# EasyEDA Pro project Tasmota_ESP32C6-RTC_Triac.eprj

# Schematic SSR_4A_5V
Board Name: SSR_4A_5V; Create Date: 2026-10-08; Page Name: P1; Project Name: Tasmota_ESP32C6-6c; Schematic Name: SSR_4A_5V; Update Date: 2026-10-08; Company: EasyEDA.com; Page Size: A4; Version: V1.0
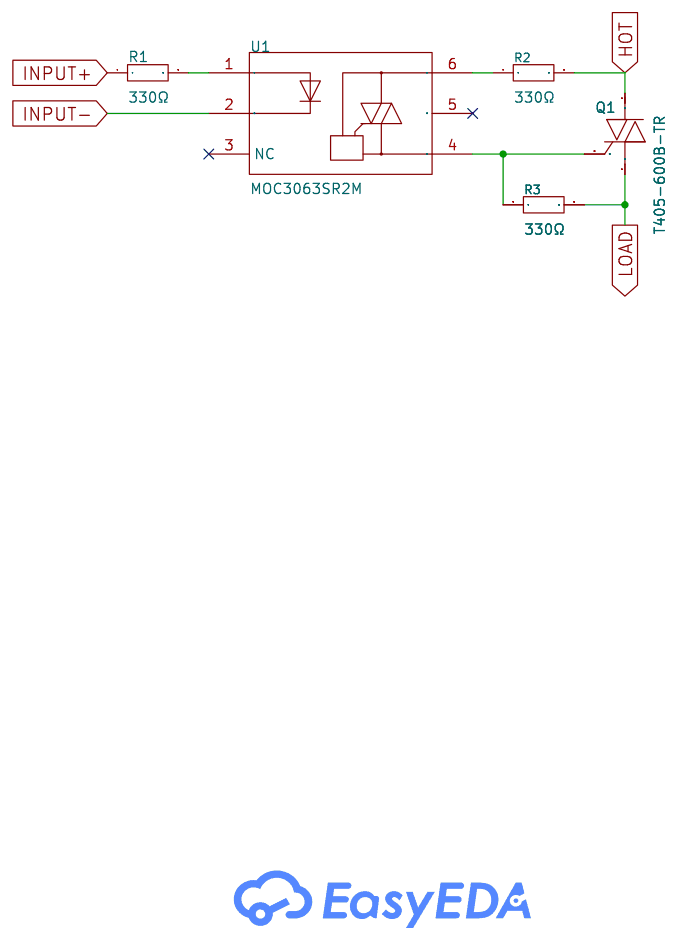
[diagram p0: schematic sheet]

## Parts
Q1  T405-600B-TR  [DPAK_L6.5-W6.0-P2.29-LS9.9-TL]
R1  330Ω  [R0805]
R2  330Ω  [R0805]
R3  330Ω  [R0805]
U1  MOC3063SR2M  [SOP-6_L8.5-W6.4-P2.54-LS9.2-BL]

## Library data of the parts
Q1 = T405-600B-TR: SCR Type:- Peak off - state voltage(Vdrm):600V Current - On State(It(RMS)):4A Current - Surge(Itsm@f):30A Average Gate Power Dissipation (PG(AV)):1W Voltage - On State(Vtm):1.56V Current - Gate Trigger(Igt):5mA Gate Trigger   Voltage (Vgt):1.3V Holding Cu; LCSC Part Name: 600V 10mA; Supplier Part: C283473; Manufacturer: ST(意法半导体); Supplier Footprint: DPAK; JLCPCB Part Class: Extended Part; Datasheet: https://item.szlcsc.com/datasheet/T405-600B-TR/269286.html; Supplier: LCSC; Peak off - state voltage(Vdrm): 600V; Current - On State(It(RMS)): 4A; Current - Surge(Itsm@f): 30A; Average Gate Power Dissipation (PG(AV)): 1W; Voltage - On State(Vtm): 1.56V; Current - Gate Trigger(Igt): 5mA; Gate Trigger   Voltage (Vgt): 1.3V; Holding Current (Ih): 10mA; Operating Temperature: -40℃~+125℃
R1-R3 = 0805W8F3300T5E: Type:Thick Film Resistor Resistance:330Ω Tolerance:±1% Tolerance:±1% Power(Watts):125mW Voltage-Supply(Max):150V Temperature Coefficient:±100ppm/℃ Temperature Coefficient:±100ppm/℃ Operating Temperature:-55℃~+155℃ Operating Temperature:-55℃~+155℃; LCSC Part Name: 厚膜电阻 330Ω ±1%; Supplier Part: C17630; Manufacturer: UNI-ROYAL(厚声); Supplier Footprint: 0805; JLCPCB Part Class: Basic Part; Datasheet: https://item.szlcsc.com/datasheet/0805W8F3300T5E/18318.html; Supplier: LCSC; Type: Thick Film Resistor; Tolerance: ±1%; Power(Watts): 125mW; Voltage-Supply(Max): 150V; Temperature Coefficient: ±100ppm/℃; Operating Temperature: -55℃~+155℃
U1 = MOC3063SR2M: Number of Channels:1 Zero Crossing Circuit:Yes Input Type:DC Output Type:TRIAC Load Voltage:600V Output Current(It(rms)):- Voltage - Forward(Vf):1.3V Forward Current:60mA Static dv/dt:600V/us Isolation Voltage(Vrms):7.5kV Power Dissipation:250mW Operating; LCSC Part Name: 双向可控硅 有过零电路 1通道; Supplier Part: C13411; Manufacturer: onsemi(安森美); Supplier Footprint: SOP-6-2.54mm; JLCPCB Part Class: Extended Part; Datasheet: https://item.szlcsc.com/datasheet/MOC3063SR2M/14060.html; Supplier: LCSC; Number of Channels: 1; Zero Crossing Circuit: Yes; Input Type: DC; Output Type: TRIAC; Load Voltage: 600V; Voltage - Forward(Vf): 1.3V; Forward Current: 60mA; Static dv/dt: 600V/us; Isolation Voltage(Vrms): 7.5kV; Power Dissipation: 250mW; Operating Temperature: -40℃~+85℃; Number of terminals: 6; Holding Current (Ih): 500uA; Current - Surge(Itsm): 1A; Features: Zero-crossing trigger

## Nets
HOT: Q1.4(A2) R2.2
INPUT+: R1.1
INPUT-: U1.2(CAT)
LOAD: Q1.1(A1) R3.2
$1N339: R1.2 U1.1(AN)
$1N2139: Q1.3(G) R3.1 U1.4(MT)
$1N2143: R2.1 U1.6(MT)

Not connected (* = marked no-connect by the designer): U1 3(NC)* 5(NC)*

# Schematic Tasmota_ESP32C6-5c_NoSSR

## Sheets
1 Tasmota_ESP32C6-5c_1: Board Name: Tasmota_ESP32C6-5c_NoSSR RTC; Create Date: 2026-10-08; Page Name: Tasmota_ESP32C6-5c_1; Project Name: Tasmota_ESP32C6-6c; Schematic Name: Tasmota_ESP32C6-5c_NoSSR; Update Date: 2026-10-09; Company: EasyEDA.com; Page Size: A5; Version: V1.0
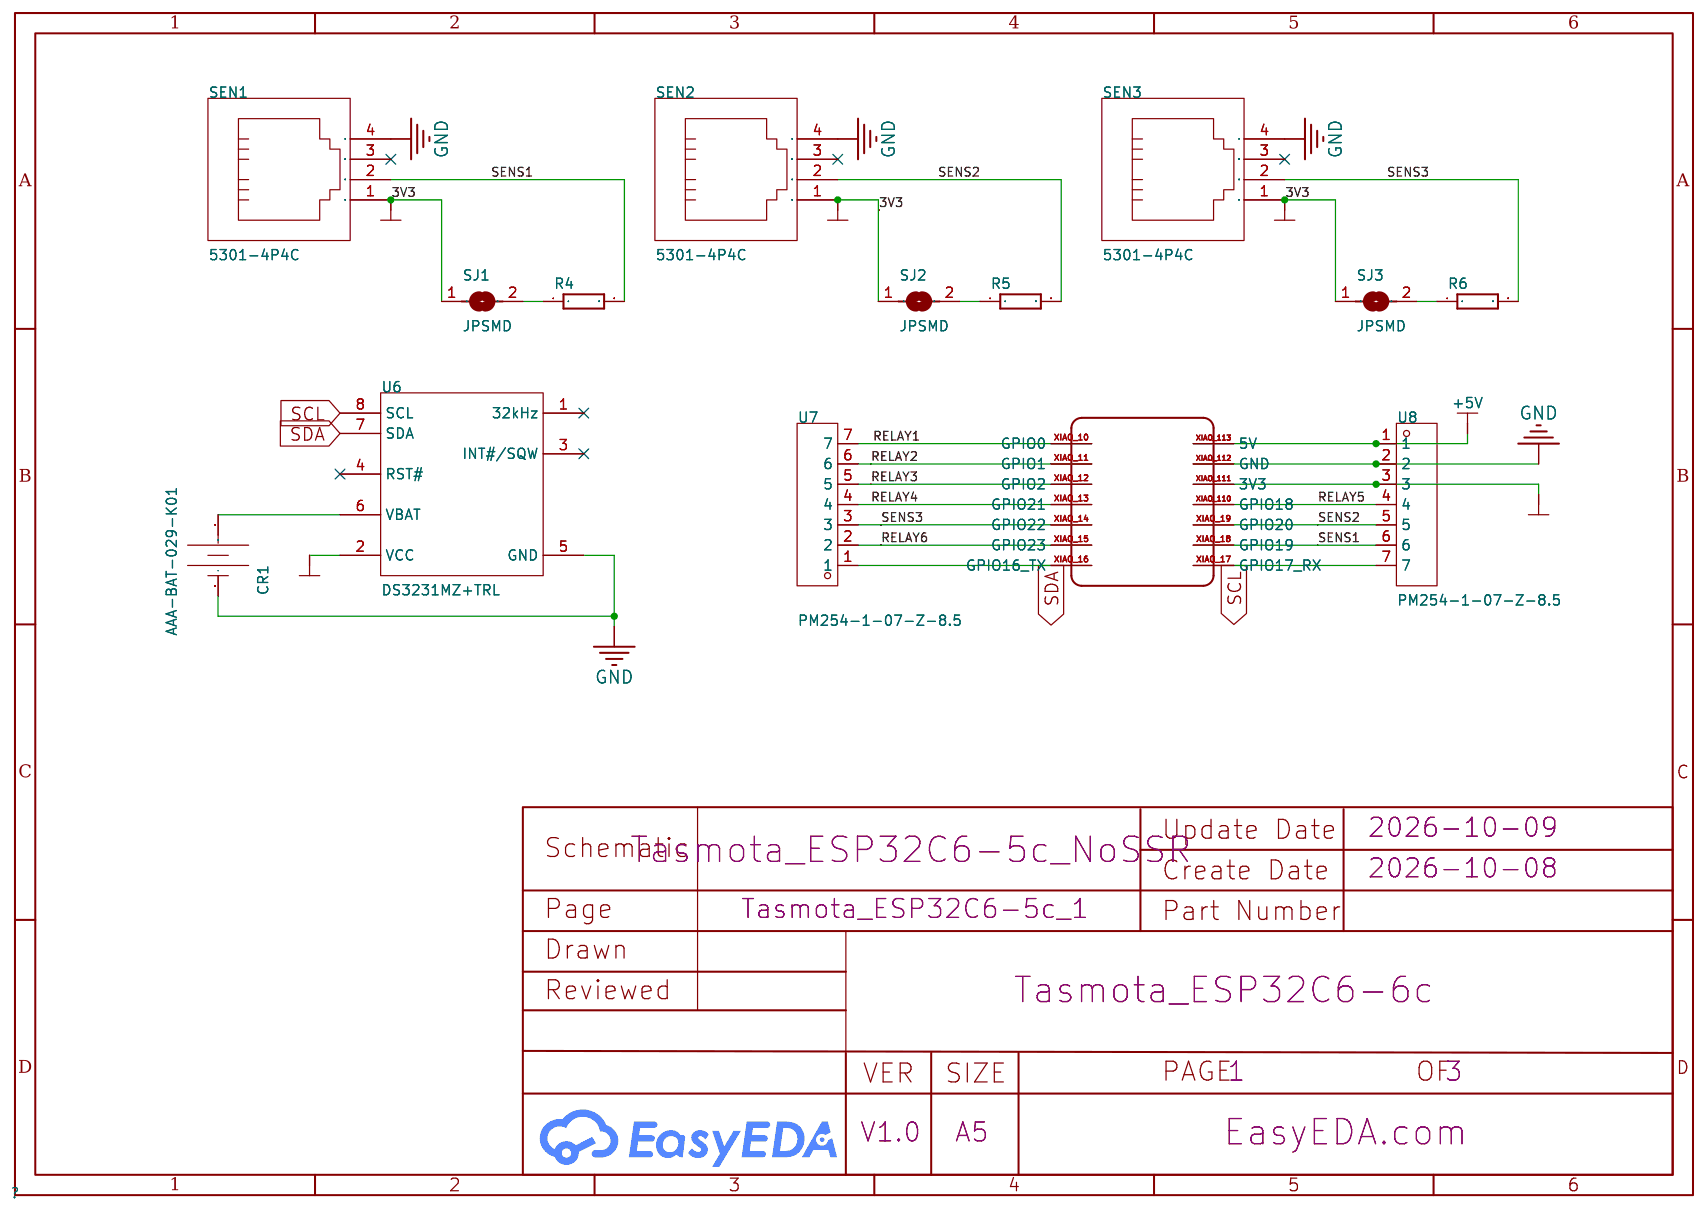
[diagram p1: Tasmota_ESP32C6-5c_1]
2 Tasmota_ESP32C6-5c_2: Page Name: Tasmota_ESP32C6-5c_2
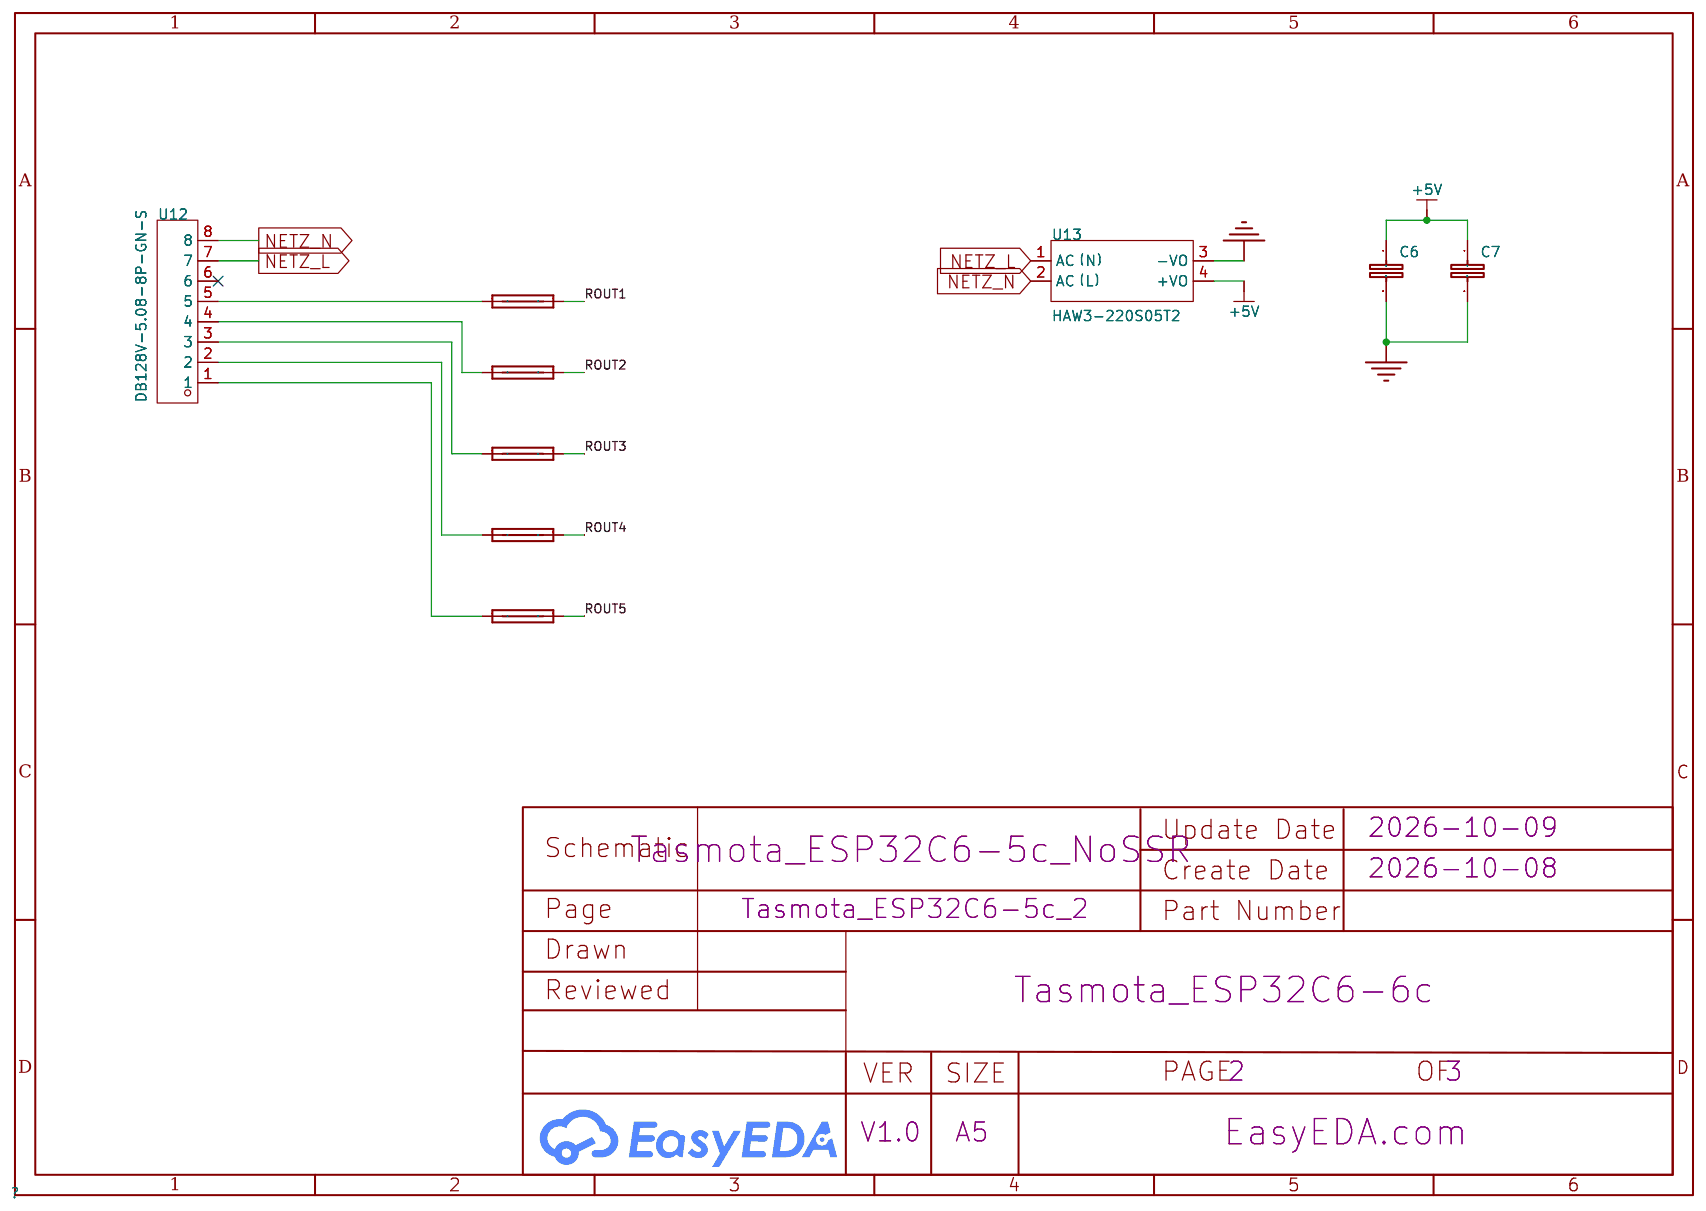
[diagram p2: Tasmota_ESP32C6-5c_2]
3 Tasmota_ESP32C6-5c_3: Page Name: Tasmota_ESP32C6-5c_3; Page Size: A4
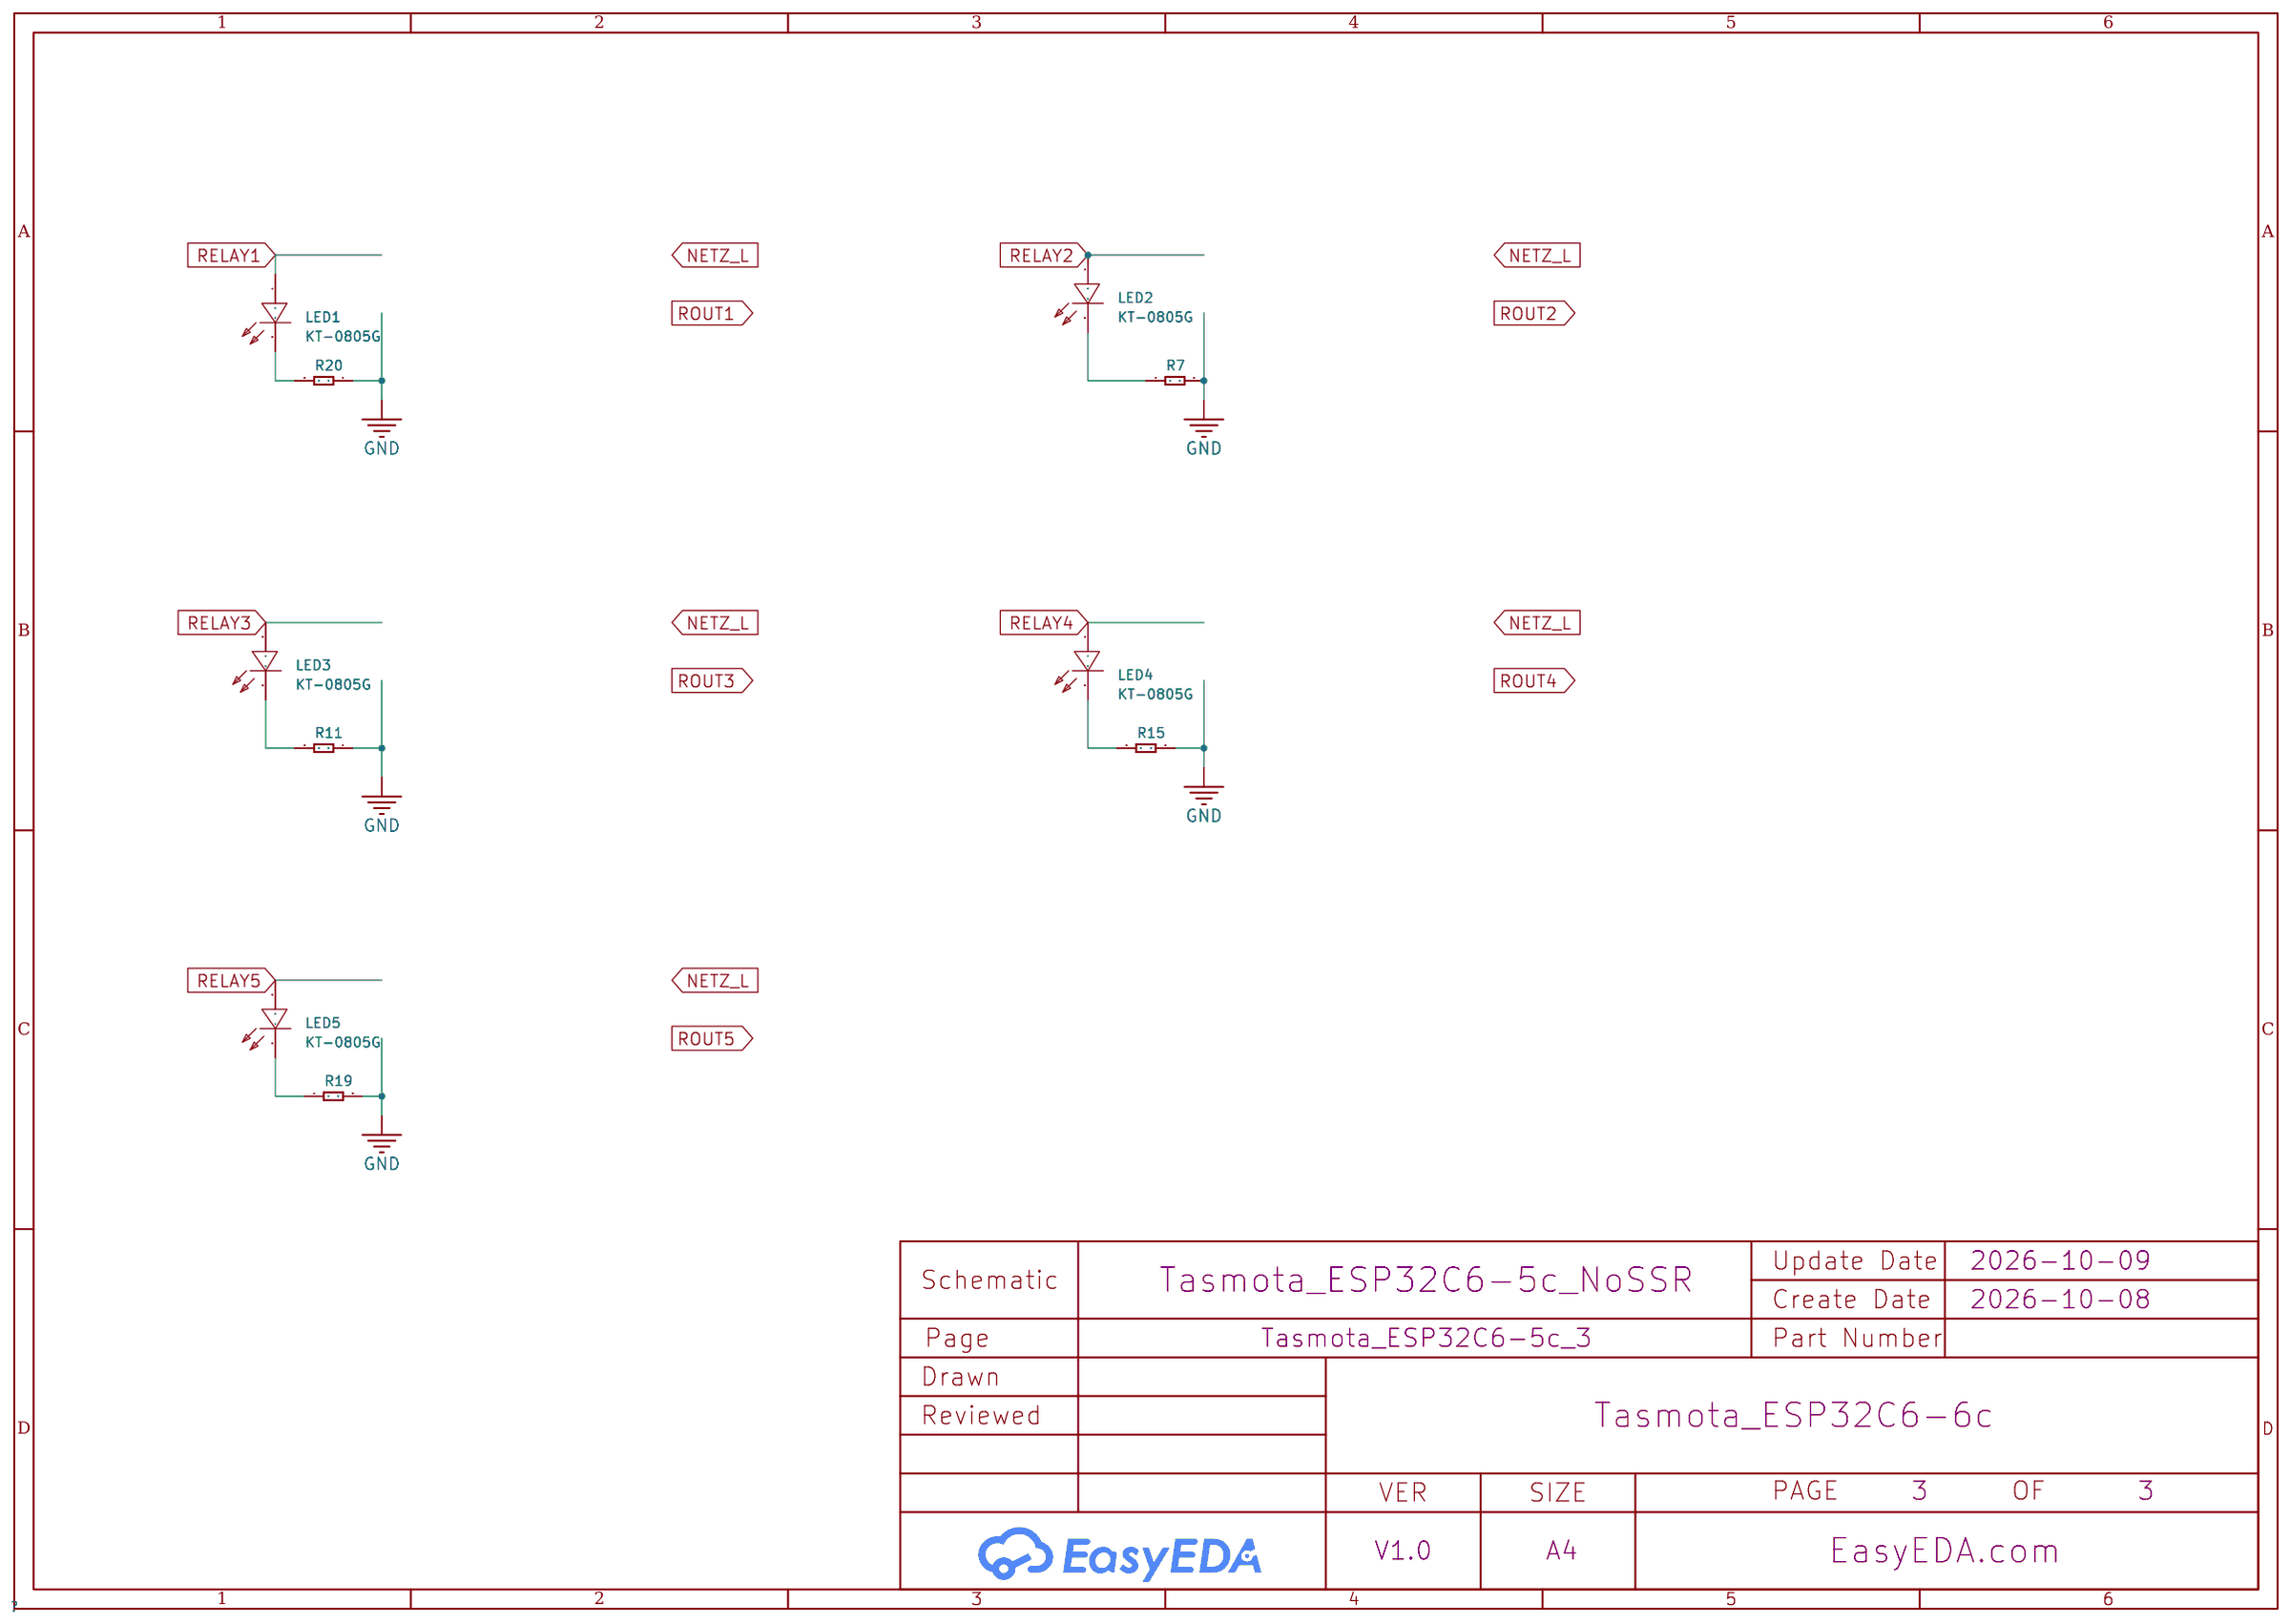
[diagram p3: Tasmota_ESP32C6-5c_3]

## Parts
sheet Tasmota_ESP32C6-5c_1
CR1  AAA-BAT-029-K01  [BAT-TH_AAA-BAT-029-K01]
R4  4.7kΩ  [R0805]
R5  4.7kΩ  [R0805]
R6  4.7kΩ  [R0805]
SEN1  5301-4P4C  [RJ11-TH_RJ11-4P4C]
SEN2  5301-4P4C  [RJ11-TH_RJ11-4P4C]
SEN3  5301-4P4C  [RJ11-TH_RJ11-4P4C]
SJ1  JPSMD  [SJ]
SJ2  JPSMD  [SJ]
SJ3  JPSMD  [SJ]
U6  DS3231MZ+TRL  [SOIC-8_L4.9-W3.9-P1.27-LS6.0-BL]
U7  PM254-1-07-Z-8.5  [HDR-TH_7P-P2.54-V-F]
U8  PM254-1-07-Z-8.5  [HDR-TH_7P-P2.54-V-F]
U$1  1x7P  [XIAO_ESP32C6]  (no BOM)
sheet Tasmota_ESP32C6-5c_2
C6  22uF  [C0805]
C7  100nF  [C0805]
F1  56000001009  [FUSE-TH_BD9.5-P5.08-D1.0]
F2  56000001009  [FUSE-TH_BD9.5-P5.08-D1.0]
F3  56000001009  [FUSE-TH_BD9.5-P5.08-D1.0]
F4  56000001009  [FUSE-TH_BD9.5-P5.08-D1.0]
F5  56000001009  [FUSE-TH_BD9.5-P5.08-D1.0]
U12  DB128V-5.08-8P-GN-S  [CONN-TH_8P-P5.08_DB128V-5.08-8P-GN-S]
U13  HAW3-220S05T2  [PWRM-TH_HAW3-220S05T2]
sheet Tasmota_ESP32C6-5c_3
CBB1  -
CBB2  -
CBB3  -
CBB4  -
CBB5  -
LED1  KT-0805G  [LED0805-R-RD]
LED2  KT-0805G  [LED0805-R-RD]
LED3  KT-0805G  [LED0805-R-RD]
LED4  KT-0805G  [LED0805-R-RD]
LED5  KT-0805G  [LED0805-R-RD]
R7  220Ω  [R0805]
R11  220Ω  [R0805]
R15  220Ω  [R0805]
R19  220Ω  [R0805]
R20  220Ω  [R0805]

## Library data of the parts
CR1 = AAA-BAT-029-K01: Connector Type:Battery Holder Battery Type:CR2032 Operating Temperature:- Operating Temperature:-; LCSC Part Name: 电池底座 适用电池:CR2032; Supplier Part: C962133; Manufacturer: LOTES(嘉澤端子); Supplier Footprint: 插件; JLCPCB Part Class: Extended Part; Datasheet: https://item.szlcsc.com/datasheet/AAA-BAT-029-K01/1043085.html; Supplier: LCSC; Connector Type: Battery Holder; Battery Type: CR2032
R4-R6 = 0805W8F4701T5E: Type:Thick Film Resistors Resistance:4.7kΩ Tolerance:±1% Tolerance:±1% Power(Watts): Overload Voltage (Max): Temperature Coefficient:±100ppm/℃ Temperature Coefficient:±100ppm/℃ Operating Temperature Range:-55℃~+155℃ Operating Temperature Range:-55℃~+155℃; LCSC Part Name: 4.7kΩ ±1% 125mW 厚膜电阻; Supplier Part: C17673; Manufacturer: UNI-ROYAL(厚声); Supplier Footprint: 0805; JLCPCB Part Class: Basic Part; Datasheet: https://atta.szlcsc.com/upload/public/pdf/source/20200306/C422600_1E6D84923E4A46A82E41ADD87F860B5C.pdf; Supplier: LCSC; Type: Thick Film Resistors; Tolerance: ±1%; Temperature Coefficient: ±100ppm/℃; Operating Temperature Range: -55℃~+155℃
SEN1-SEN3 = 5301-4P4C: Connector Type:RJ11 Jack Mounting Type:Right Angle Number of Ports:1 LED:Non-LED Shielding:Unshielded PoE:Non-PoE Supplementary Features:Harpoon Contact (Plastic) Contact Material:Phosphor Bronze Contact Plating:Gold Operating Temperature:-40℃~+85℃ Operat; LCSC Part Name: 弯插 不带LED; Supplier Part: C3097715; Manufacturer: EVERCOM(恒连); Supplier Footprint: 弯插; JLCPCB Part Class: Extended Part; Datasheet: https://item.szlcsc.com/datasheet/5301-4P4C/3657110.html; Supplier: LCSC; Connector Type: RJ11 Jack; Mounting Type: Right Angle; Number of Ports: 1; LED: Non-LED; Shielding: Unshielded; PoE: Non-PoE; Supplementary Features: Harpoon Contact (Plastic); Contact Material: Phosphor Bronze; Contact Plating: Gold; Operating Temperature: -40℃~+85℃
SJ1-SJ3 = jumper_SJ_: POPULARITY: 33
U6 = DS3231MZ+TRL: Interface:I2C Voltage - Supply:2.3V~5.5V Voltage - Supply:2.3V~5.5V Operating Temperature:-40℃~+85℃ Operating Temperature:-40℃~+85℃; LCSC Part Name: 高精度RTC集成MEMS谐振器; Supplier Part: C107410; Manufacturer: ADI(亚德诺)/MAXIM(美信); Supplier Footprint: SOIC-8; JLCPCB Part Class: Extended Part; Datasheet: https://item.szlcsc.com/datasheet/DS3231MZ%252BTRL/108629.html; Supplier: LCSC; Interface: I2C; Voltage - Supply: 2.3V~5.5V; Operating Temperature: -40℃~+85℃
U7 U8 = PM254-1-07-Z-8.5: Holes Structure:1x7P Pitch:2.54mm Row Spacing:- Circular Hole / Square Hole:Square Hole Mounting Type:Through Hole Number of Rows:1 Number of Positions:7P Current Rating:3A Voltage Rating (Max):- Holes Direction:Top Insulation Height:8.5mm Contact Materia; LCSC Part Name: 1x7P 间距:2.54mm 直插; Supplier Part: C2897370; Manufacturer: HCTL(华灿天禄); Supplier Footprint: 插件,P=2.54mm; JLCPCB Part Class: Extended Part; Datasheet: https://item.szlcsc.com/datasheet/PM254-1-07-Z-8.5/3142375.html; Supplier: LCSC; Holes Structure: 1x7P; Pitch: 2.54mm; Circular Hole / Square Hole: Square Hole; Mounting Type: Through Hole; Number of Rows: 1; Number of Positions: 7P; Current Rating: 3A; Holes Direction: Top; Insulation Height: 8.5mm; Contact Material: Copper Alloy; Operating Temperature: -40℃~+105℃
U$1 = MK312parts_XIAO_ESP32C6_
C6 = CL21A226MAQNNNE: Capacitance:22uF Tolerance:±20% Tolerance:±20% Voltage Rating:25V Temperature Coefficient:X5R; LCSC Part Name: 22uF ±20% 25V; Supplier Part: C45783; Manufacturer: SAMSUNG(三星); Supplier Footprint: 0805; JLCPCB Part Class: Basic Part; Datasheet: https://item.szlcsc.com/datasheet/CL21A226MAQNNNE/46786.html; Supplier: LCSC; Tolerance: ±20%; Voltage Rating: 25V; Temperature Coefficient: X5R; POPULARITY: 88; SPICEPREFIX: C
C7 = CL21B104KCFNNNE: Capacitance:100nF Tolerance:±10% Tolerance:±10% Voltage Rating:100V Temperature Coefficient:X7R; LCSC Part Name: 100nF ±10% 100V; Supplier Part: C28233; Manufacturer: SAMSUNG(三星); Supplier Footprint: 0805; JLCPCB Part Class: Basic Part; Datasheet: https://item.szlcsc.com/datasheet/CL21B104KCFNNNE/28983.html; Supplier: LCSC; Tolerance: ±10%; Voltage Rating: 100V; Temperature Coefficient: X7R; POPULARITY: 88; SPICEPREFIX: C
F1-F5 = 56000001009: Fuseholder Type:- Voltage Rating:250V Current Rating:6.3A Fuse Type:-; LCSC Part Name: 保险丝座; Supplier Part: C142909; Manufacturer: Littelfuse(美国力特); Supplier Footprint: 插件,P=5.08mm; JLCPCB Part Class: Extended Part; Datasheet: https://item.szlcsc.com/datasheet/56000001009/154240.html; Supplier: LCSC; Voltage Rating: 250V; Current Rating: 6.3A
U12 = DB128V-5.08-8P-GN-S: Number of Positions or Pins:1x8P Pitch:5.08mm Color:Green Mounting Type:Through Hole Number of Pins:8P Number of Rows:1 Number of PINs Per Row:8 Screw Specification:M2.5 Current Rating:16A Voltage Rating (Max):300V Wire Gauge - AWG:12~22 Wire Gauge - mm2:; LCSC Part Name: 1x8P 5.08mm 直插 排数:1 每排P数:8; Supplier Part: C5143711; Manufacturer: DORABO(地博电气); Supplier Footprint: 插件,P=5.08mm; JLCPCB Part Class: Extended Part; Datasheet: https://item.szlcsc.com/datasheet/DB128V-5.08-8P-GN-S/5763845.html; Supplier: LCSC; Number of Positions or Pins: 1x8P; Pitch: 5.08mm; Color: Green; Mounting Type: Through Hole; Number of Pins: 8P; Number of Rows: 1; Number of PINs Per Row: 8; Screw Specification: M2.5; Current Rating: 16A; Voltage Rating (Max): 300V; Wire Gauge - AWG: 12~22; Wire Gauge - mm2: 2.5; Operating Temperature: -40℃~+105℃; Height Above Board: 14mm
U13 = HAW3-220S05T2: Conversion Type:AC/DC-DC Number of Outputs:1 Voltage - Input(DC):- Voltage - Input(DC):- Voltage - Input(AC):85VAC~305VAC Voltage - Input(AC):85VAC~305VAC Output Voltage:5V Output Voltage:5V Output Voltage Accuracy:±2% Output Voltage Accuracy:±2% Output C; LCSC Part Name: 3W隔离稳压单路输出AC/DC电源模块; Supplier Part: C19724491; Manufacturer: YLPTEC(易川); Supplier Footprint: DIP,34x20mm; JLCPCB Part Class: Extended Part; Datasheet: https://item.szlcsc.com/datasheet/HAW3-220S05T2/21043565.html; Supplier: LCSC; Conversion Type: AC/DC-DC; Number of Outputs: 1; Voltage - Input(AC): 85VAC~305VAC; Output Voltage: 5V; Output Voltage Accuracy: ±2%; Output Current(Max): 600mA; Output Power: 3W; Quiescent Dissipation: 0.1W; Conversion Efficiency: 71%; Ripple Noise: 80mVp-p; Capacitive Load(Max): 1000uF; Features: Short Circuit Protection；Over Voltage Protection；Over Temperature Protection；Over Current Protection; Isolation Voltage(Vrms): 3kV; Length: 34mm; Width: 20mm; Height: 15mm; Switching Frequency: 65kHz
LED1-LED5 = KT-0805G: Lamp Holder Type:2mm x 1.25mm square LED Illumination Color:Emerald Green Voltage - Forward(Vf):2.6V~3.1V Voltage - Forward(Vf):2.6V~3.1V Power(Watts):100mW Forward Current:5mA Wavelength - Dominant:513nm~528nm Wavelength - Dominant:513nm~528nm Peak Wavel; LCSC Part Name: 0805 翠绿 高亮; Supplier Part: C2297; Manufacturer: KENTO; Supplier Footprint: 0805; JLCPCB Part Class: Basic Part; Datasheet: https://item.szlcsc.com/datasheet/KT-0805G/2670.html; Supplier: LCSC; Lamp Holder Type: 2mm x 1.25mm square LED; Illumination Color: Emerald Green; Voltage - Forward(Vf): 2.6V~3.1V; Power(Watts): 100mW; Forward Current: 5mA; Wavelength - Dominant: 513nm~528nm; Peak Wavelength: 525nm; Diode Configuration: Discrete Diode; Lens Color: Water Clear; Luminous Intensity: 430mcd; Viewing Angle: 120°; Operating Temperature: -40℃~+85℃
R7 R11 R15 R19 R20 = 0805W8F2200T5E: Type:Thick Film Resistor Resistance:220Ω Tolerance:±1% Tolerance:±1% Power(Watts):125mW Voltage-Supply(Max):150V Temperature Coefficient:±100ppm/℃ Temperature Coefficient:±100ppm/℃ Operating Temperature:-55℃~+155℃ Operating Temperature:-55℃~+155℃; LCSC Part Name: 厚膜电阻 220Ω ±1%; Supplier Part: C17557; Manufacturer: UNI-ROYAL(厚声); Supplier Footprint: 0805; JLCPCB Part Class: Basic Part; Datasheet: https://item.szlcsc.com/datasheet/0805W8F2200T5E/18245.html; Supplier: LCSC; Type: Thick Film Resistor; Tolerance: ±1%; Power(Watts): 125mW; Voltage-Supply(Max): 150V; Temperature Coefficient: ±100ppm/℃; Operating Temperature: -55℃~+155℃

## Nets
3V3: SEN1.1 SEN2.1 SEN3.1 SJ1.1 SJ2.1 SJ3.1 U6.2(VCC) U8.3 U$1.XIAO_111(3V3)
+5V: C6.1 C7.1 U8.1 U13.4(+VO) U$1.XIAO_113(5V)
GND: C6.2 C7.2 CBB1.(INPUT-) CBB2.(INPUT-) CBB3.(INPUT-) CBB4.(INPUT-) CBB5.(INPUT-) CR1.2(-) F1.2 F2.2 F3.2 F4.2 F5.2 LED1.1(A) LED2.1(A) LED3.1(A) LED4.1(A) LED5.1(A) R7.2 R11.1 R15.2 R19.2 R20.1 SEN1.4 SEN2.4 SEN3.4 U6.5(GND) U7.4 U7.5 U7.6 U7.7 U8.2 U8.4 U12.7 U13.1(AC（N）) U13.3(-VO) U$1.XIAO_10(GPIO0) U$1.XIAO_11(GPIO1) U$1.XIAO_12(GPIO2) U$1.XIAO_13(GPIO21) U$1.XIAO_110(GPIO18) U$1.XIAO_112(GND)
N$4: R4.1 SJ1.2
N$5: R5.1 SJ2.2
N$10: R6.1 SJ3.2
NETZ_N: U12.8 U13.2(AC（L）)
RELAY6: U7.2 U$1.XIAO_15(GPIO23)
SCL: U6.8(SCL) U8.7 U$1.XIAO_17(GPIO17_RX)
SDA: U6.7(SDA) U7.1 U$1.XIAO_16(GPIO16_TX)
SENS1: R4.2 SEN1.2 U8.6 U$1.XIAO_18(GPIO19)
SENS2: R5.2 SEN2.2 U8.5 U$1.XIAO_19(GPIO20)
SENS3: R6.2 SEN3.2 U7.3 U$1.XIAO_14(GPIO22)
$2N7067: F1.1 U12.5
$2N7071: F2.1 U12.4
$2N7077: F3.1 U12.3
$2N7084: F4.1 U12.2
$2N7104: F5.1 U12.1
$3N16978: LED2.2(K) R7.1
$3N17018: LED1.2(K) R20.2
$3N17114: LED3.2(K) R11.2
$3N17181: LED4.2(K) R15.1
$3N17236: LED5.2(K) R19.1
Net-(CR1-1): CR1.1(+) U6.6(VBAT)

Not connected (* = marked no-connect by the designer): SEN1 3*; SEN2 3*; SEN3 3*; U6 1(32kHz)* 3(INT#/SQW)* 4(RST#)*; U12 6*

# Board SSR_4A_5V
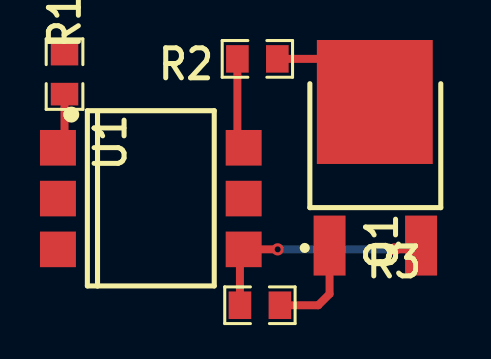
[diagram p4: board, top side]
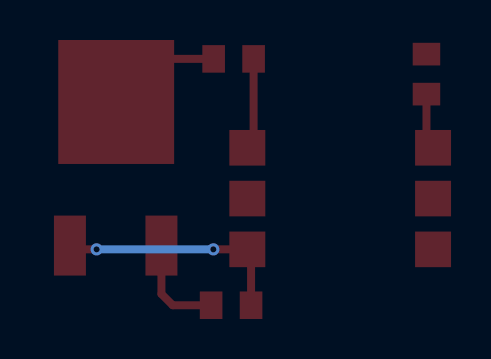
[diagram p5: board, bottom side, seen from below]

No outline. copper layers: Top Layer, Bottom Layer. Coordinates in mm from the lowest, leftmost part position.
Stack: Top Layer 0.035mm / Dielectric1 1.51mm FR4 er 4.5 / Bottom Layer 0.035mm

## Design rules (mm)
template: JLCPCB Capability(Two Layers Board)
spacing copperThickness1oz (default): track to track 0.102, other pairs 0.152 to 0.3
spacing copperThickness2oz: track to track 0.203, other pairs 0.152 to 0.3
track width copperThickness1oz (default): min 0.127, default 0.254, max 2.54
track width copperThickness2oz: min 0.203, default 0.254, max 2.54
differential pair differentialPair (default): width min 0.127, default 0.254, max 2.54; gap min 0.152, default 0.152
via viaSize (default): diameter min 0.5, default 0.61, max 10; hole min 0.3, default 0.305, max 6.3

## Placement (name value [footprint] x y rotation side)
Q1  T405-600B-TR  [DPAK_L6.5-W6.0-P2.29-LS9.9-TL]  15.56 6.57 90 top
R1  330Ω  [R0805]  0 11.56 270 top
R2  330Ω  [R0805]  9.65 12.32 0 top
R3  330Ω  [R0805]  9.78 0 0 top
U1  MOC3063SR2M  [SOP-6_L8.5-W6.4-P2.54-LS9.2-BL]  4.32 5.33 270 top

## Footprints (pads in the part's own frame, mm; a bottom-side part is the same pattern mirrored in y, then rotated)
DPAK_L6.5-W6.0-P2.29-LS9.9-TL
  rect 3x1.6 smd: 1(-3.59,2.29) 3(-3.59,-2.29)
  rect 6.2x5.8 smd: 4(3.59,0.025)
R0805
  rect 1.133x1.377 smd: 1(-1,0) 2(1,0)
SOP-6_L8.5-W6.4-P2.54-LS9.2-BL
  rect 1.78x1.8 smd: 1(-2.54,-4.648) 2(0,-4.648) 3(2.54,-4.648) 4(2.54,4.648) 5(0,4.648) 6(-2.54,4.648)

## Nets
As in the schematic.

Pads without a net: U1 3 5

## Via types
v1: diameter 0.61, hole 0.305, Top Layer to Bottom Layer, 2 vias

## Routing (per net, layer and track width the routed paths; a pad name or vN(x,y) marks a point on that pad's centre or on a via; arc(x,y) is an arc through that point)
HOT: length 5.8
  Top Layer w0.4: R2.2 13.37,12.32 Q1.4
LOAD: length 5.1
  Top Layer w0.4: R3.2 12.7,0 13.27,0.56 Q1.1
$1N339: length 3.1
  Top Layer w0.4: R1.2 0,7.94 ; 0,8.2 U1.1
$1N2139: length 11.8
  Top Layer w0.4: R3.1 8.78,2.61 U1.4 v1(10.67,2.79) ; 17.84,2.98 17.66,2.79 v1(16.51,2.79)
  Bottom Layer w0.4: v1(10.67,2.79) v1(16.51,2.79)
$1N2143: length 4.6
  Top Layer w0.4: U1.6 8.65,8.19 R2.1

# Board Tasmota_ESP32C6-5c_NoSSR_V2
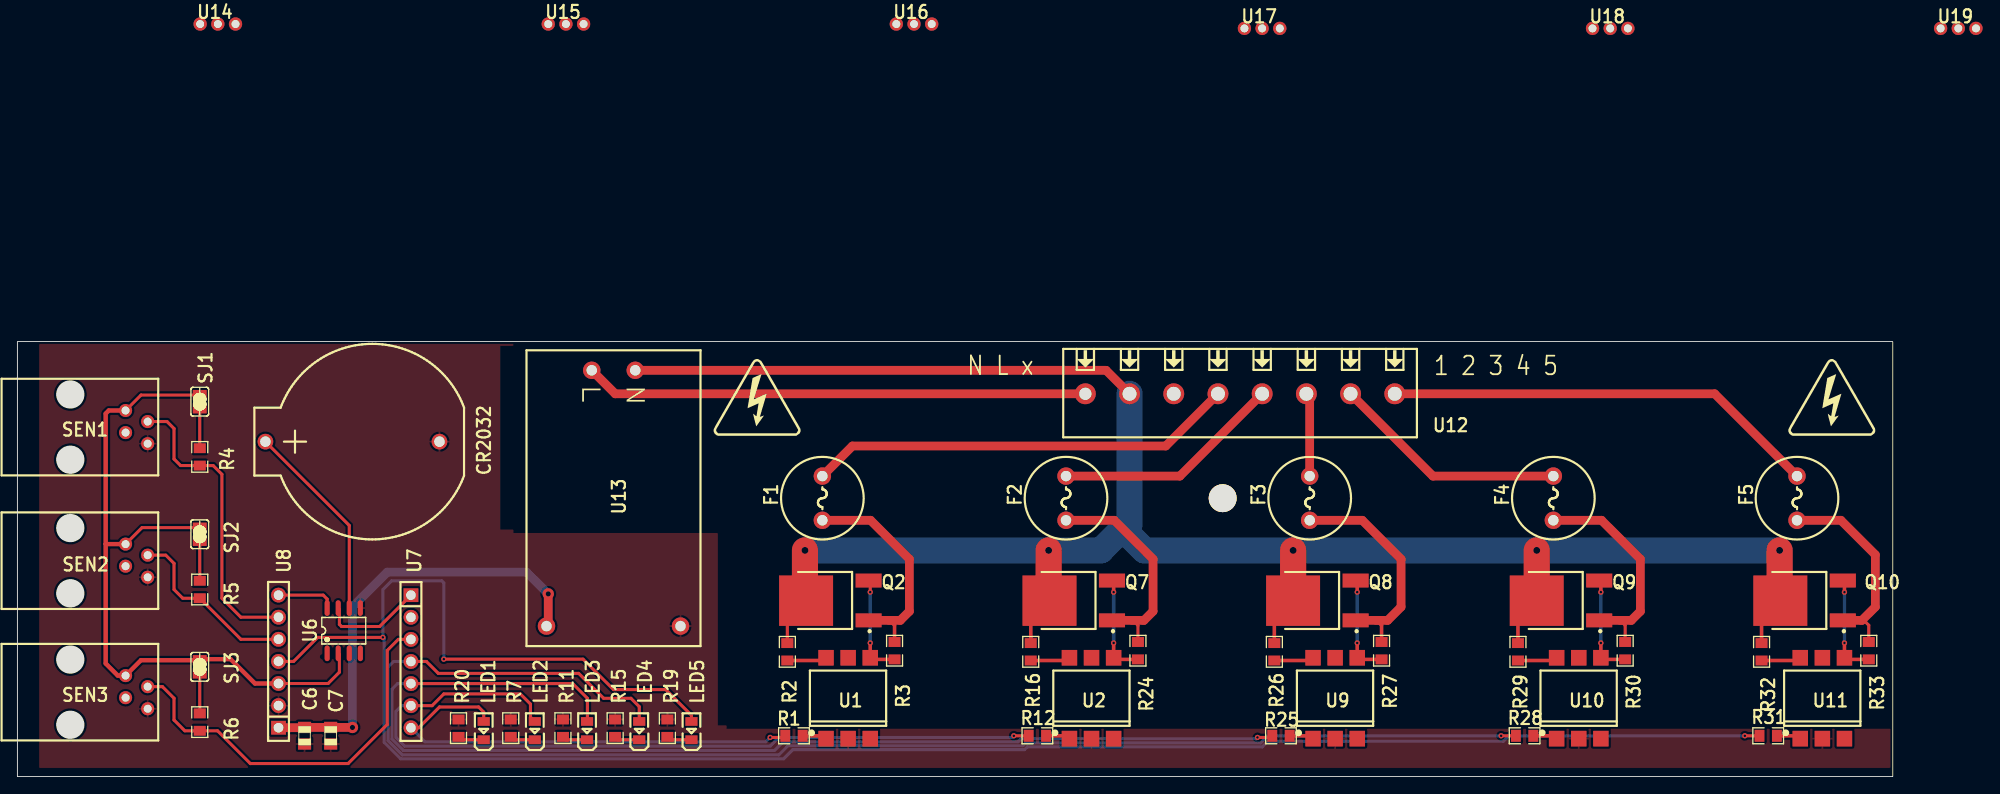
[diagram p6: board, top side]
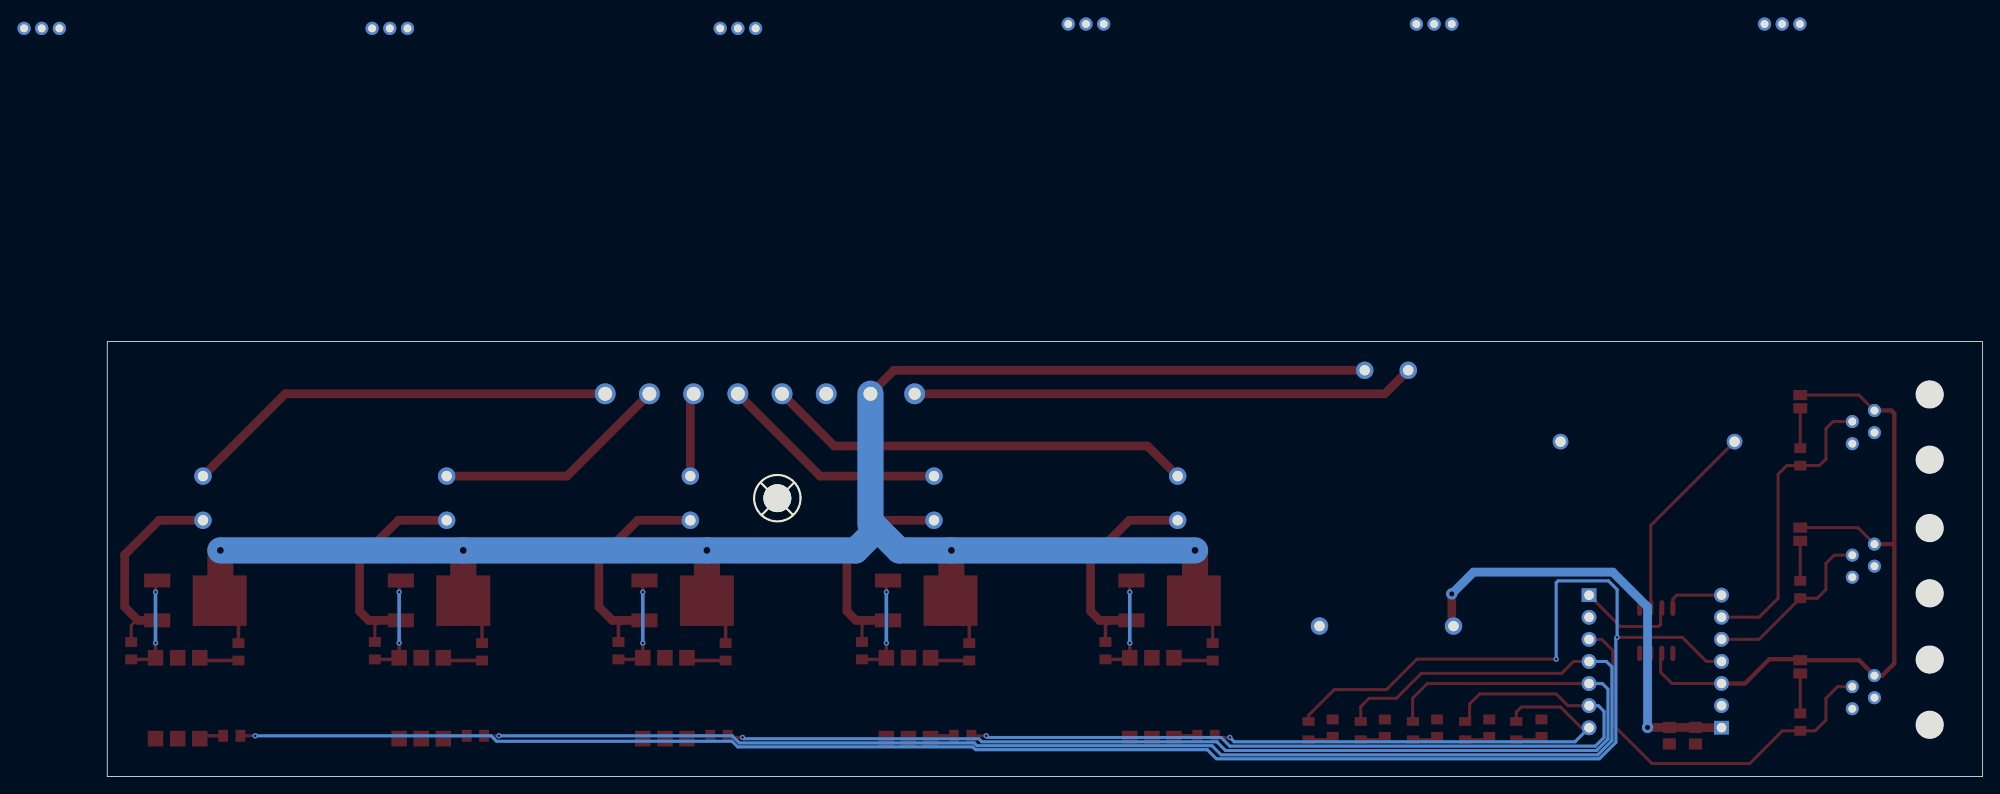
[diagram p7: board, bottom side, seen from below]

Outline 215.5 x 50 mm; copper layers: Top Layer, Bottom Layer. Coordinates in mm from the lower left corner of the outline.
Outline path: rectangle 0,50 215.5,0
Stack: Top Layer 0.035mm / Dielectric1 1.51mm FR4 er 4.5 / Bottom Layer 0.035mm

## Design rules (mm)
template: Custom Config
spacing copperThickness1oz (default): track to track 0.102, other pairs 0.152 to 0.3
spacing copperThickness2oz: track to track 0.203, other pairs 0.152 to 0.3
track width copperThickness1oz (default): min 0.2, default 0.35, max 4
track width copperThickness2oz: min 0.203, default 0.254, max 2.54
differential pair differentialPair (default): width min 0.127, default 0.254, max 2.54; gap min 0.152, default 0.152
via viaSize (default): diameter min 0.5, default 0.61, max 10; hole min 0.3, default 0.305, max 6.3

## Placement (name value [footprint] x y rotation side)
C6  22uF  [C0805]  33 4.7 270 top
C7  100nF  [C0805]  36 4.7 270 top
CR2032  AAA-BAT-029-K01  [BAT-TH_AAA-BAT-029-K01]  38.5 38.5 180 top
F1  56000001009  [FUSE-TH_BD9.5-P5.08-D1.0]  92.5 32 270 top
F2  56000001009  [FUSE-TH_BD9.5-P5.08-D1.0]  120.5 32 270 top
F3  56000001009  [FUSE-TH_BD9.5-P5.08-D1.0]  148.5 32 270 top
F4  56000001009  [FUSE-TH_BD9.5-P5.08-D1.0]  176.5 32 270 top
F5  56000001009  [FUSE-TH_BD9.5-P5.08-D1.0]  204.5 32 270 top
LED1  KT-0805G  [LED0805-R-RD]  53.58 5.29 90 top
LED2  KT-0805G  [LED0805-R-RD]  59.46 5.29 90 top
LED3  KT-0805G  [LED0805-R-RD]  65.46 5.29 90 top
LED4  KT-0805G  [LED0805-R-RD]  71.46 5.29 90 top
LED5  KT-0805G  [LED0805-R-RD]  77.46 5.29 90 top
Q2  T405-600B-TR  [DPAK_L6.5-W6.0-P2.29-LS9.9-TL]  94.22 20.25 180 top
Q7  T405-600B-TR  [DPAK_L6.5-W6.0-P2.29-LS9.9-TL]  122.19 20.25 180 top
Q8  T405-600B-TR  [DPAK_L6.5-W6.0-P2.29-LS9.9-TL]  150.18 20.25 180 top
Q9  T405-600B-TR  [DPAK_L6.5-W6.0-P2.29-LS9.9-TL]  178.18 20.25 180 top
Q10  T405-600B-TR  [DPAK_L6.5-W6.0-P2.29-LS9.9-TL]  206.17 20.25 180 top
R1  330Ω  [R0805]  89.24 4.69 0 top
R2  330Ω  [R0805]  88.48 14.34 90 top
R3  330Ω  [R0805]  100.8 14.47 90 top
R4  4.7kΩ  [R0805]  20.95 36.75 270 top
R5  4.7kΩ  [R0805]  20.95 21.5 270 top
R6  4.7kΩ  [R0805]  20.95 6.27 270 top
R7  220Ω  [R0805]  56.69 5.57 90 top
R11  220Ω  [R0805]  62.69 5.57 270 top
R12  330Ω  [R0805]  117.21 4.69 0 top
R15  220Ω  [R0805]  68.69 5.57 90 top
R16  330Ω  [R0805]  116.45 14.34 90 top
R19  220Ω  [R0805]  74.69 5.57 90 top
R20  220Ω  [R0805]  50.69 5.57 270 top
R24  330Ω  [R0805]  128.76 14.47 90 top
R25  330Ω  [R0805]  145.2 4.69 0 top
R26  330Ω  [R0805]  144.44 14.34 90 top
R27  330Ω  [R0805]  156.76 14.47 90 top
R28  330Ω  [R0805]  173.2 4.69 0 top
R29  330Ω  [R0805]  172.43 14.34 90 top
R30  330Ω  [R0805]  184.75 14.47 90 top
R31  330Ω  [R0805]  201.19 4.69 0 top
R32  330Ω  [R0805]  200.43 14.34 90 top
R33  330Ω  [R0805]  212.75 14.47 90 top
SCREW1  -  [Screw-Hole-M3]  138.44 31.94 180 bottom
SEN1  5301-4P4C  [RJ11-TH_RJ11-4P4C]  13.7 40.17 270 top
SEN2  5301-4P4C  [RJ11-TH_RJ11-4P4C]  13.7 24.82 270 top
SEN3  5301-4P4C  [RJ11-TH_RJ11-4P4C]  13.7 9.7 270 top
SJ1  JPSMD  [SJ]  20.95 43.09 270 top
SJ2  JPSMD  [SJ]  20.95 27.86 270 top
SJ3  JPSMD  [SJ]  20.95 12.61 270 top
U1  MOC3063SR2M  [SOP-6_L8.5-W6.4-P2.54-LS9.2-BL]  95.46 9.01 0 top
U2  MOC3063SR2M  [SOP-6_L8.5-W6.4-P2.54-LS9.2-BL]  123.43 9.01 0 top
U6  DS3231MZ+TRL  [SOIC-8_L4.9-W3.9-P1.27-LS6.0-BL]  37.5 16.77 0 top
U7  PM254-1-07-Z-8.5  [HDR-TH_7P-P2.54-V-F]  45.22 13.23 270 top
U8  PM254-1-07-Z-8.5  [HDR-TH_7P-P2.54-V-F]  30 13.24 90 top
U9  MOC3063SR2M  [SOP-6_L8.5-W6.4-P2.54-LS9.2-BL]  151.42 9.01 0 top
U10  MOC3063SR2M  [SOP-6_L8.5-W6.4-P2.54-LS9.2-BL]  179.42 9.01 0 top
U11  MOC3063SR2M  [SOP-6_L8.5-W6.4-P2.54-LS9.2-BL]  207.41 9.01 0 top
U12  DB128V-5.08-8P-GN-S  [CONN-TH_8P-P5.08_DB128V-5.08-8P-GN-S]  140.5 44 180 top
U13  HAW3-220S05T2  [PWRM-TH_HAW3-220S05T2]  68.5 32 270 top
U14  -  [Wieland 3P Dummy]  21 86.5 0 top
U15  -  [Wieland 3P Dummy]  61 86.5 0 top
U16  -  [Wieland 3P Dummy]  101 86.5 0 top
U17  -  [Wieland 3P Dummy]  141 86 0 top
U18  -  [Wieland 3P Dummy]  181 86 0 top
U19  -  [Wieland 3P Dummy]  221 86 0 top

## Footprints (pads in the part's own frame, mm; a bottom-side part is the same pattern mirrored in y, then rotated)
BAT-TH_AAA-BAT-029-K01
  round 1.8 hole 1.2: 1(10,0) 2(-10,0)
C0805
  rect 1.3x1.5 smd: 1(-0.95,0) 2(0.95,0)
CONN-TH_8P-P5.08_DB128V-5.08-8P-GN-S
  round 2.4 hole 1.6: 1(-17.78,0) 2(-12.7,0) 3(-7.62,0) 4(-2.54,0) 5(2.54,0) 6(7.62,0) 7(12.7,0)
  round 2.4 hole 1.4: 8(17.78,0)
DPAK_L6.5-W6.0-P2.29-LS9.9-TL
  rect 3x1.6 smd: 1(-3.59,2.29) 3(-3.59,-2.29)
  rect 6.2x5.8 smd: 4(3.59,0.025)
FUSE-TH_BD9.5-P5.08-D1.0
  round 2 hole 1.2: 1(-2.54,0) 2(2.54,0)
HDR-TH_7P-P2.54-V-F
  rect 1.575x1.7 hole 1.1: 1(-7.62,0)
  round 1.7 hole 1.1: 2(-5.08,0) 3(-2.54,0) 4(0,0) 5(2.54,0) 6(5.08,0) 7(7.62,0)
LED0805-R-RD
  rect 1x1.399 smd: 1(1.05,0) 2(-1.05,0)
PWRM-TH_HAW3-220S05T2
  round 2 hole 1.2: 1(-14.7,2.5) 2(-14.7,-2.5) 3(14.7,7.7) 4(14.7,-7.7)
R0805
  rect 1.133x1.377 smd: 1(-1,0) 2(1,0)
RJ11-TH_RJ11-4P4C
  round 1.498 hole 0.914: 1(-1.905,-1.27) 2(-0.635,1.27) 3(0.635,-1.27) 4(1.905,1.27)
Screw-Hole-M3
  round 3.2 hole 3.2: 1(-0.064,0.064)
SJ
  rect 1.169x1.6 smd: 1(-0.762,0) 2(0.762,0)
SOIC-8_L4.9-W3.9-P1.27-LS6.0-BL
  oval 0.588x1.8 smd: 1(-1.905,-2.6) 2(-0.635,-2.6) 3(0.635,-2.6) 4(1.905,-2.6) 5(1.905,2.6) 6(0.635,2.6) 7(-0.635,2.6) 8(-1.905,2.6)
SOP-6_L8.5-W6.4-P2.54-LS9.2-BL
  rect 1.78x1.8 smd: 1(-2.54,-4.648) 2(0,-4.648) 3(2.54,-4.648) 4(2.54,4.648) 5(0,4.648) 6(-2.54,4.648)
Wieland 3P Dummy
  round 1.524 hole 0.914: 1(0,0) 2(2.032,0) 3(4.064,0)

## Nets
3V3: SEN1.1 SEN2.1 SEN3.1 SJ1.1 SJ2.1 SJ3.1 U6.2 U8.3
+5V: C6.1 C7.1 U8.1 U13.4
GND: C6.2 C7.2 CR2032.2 R7.2 R11.1 R15.2 R19.2 R20.1 SEN1.4 SEN2.4 SEN3.4 U1.2 U2.2 U6.5 U8.2 U9.2 U10.2 U11.2 U13.3
$3I14456\$1N339: R1.2 U1.1
$3I14456\$1N2139: Q2.3 R3.1 U1.4
$3I14456\$1N2143: R2.1 U1.6
$3I14478\$1N339: R12.2 U2.1
$3I14478\$1N2139: Q7.3 R24.1 U2.4
$3I14478\$1N2143: R16.1 U2.6
$3I14500\$1N339: R25.2 U9.1
$3I14500\$1N2139: Q8.3 R27.1 U9.4
$3I14500\$1N2143: R26.1 U9.6
$3I14522\$1N339: R28.2 U10.1
$3I14522\$1N2139: Q9.3 R30.1 U10.4
$3I14522\$1N2143: R29.1 U10.6
$3I14544\$1N339: R31.2 U11.1
$3I14544\$1N2139: Q10.3 R33.1 U11.4
$3I14544\$1N2143: R32.1 U11.6
N$4: R4.1 SJ1.2
N$5: R5.1 SJ2.2
N$10: R6.1 SJ3.2
NETZ_L: Q2.4 Q7.4 Q8.4 Q9.4 Q10.4 R2.2 R16.2 R26.2 R29.2 R32.2 U12.7 U13.1
NETZ_N: U12.8 U13.2
RELAY1: LED1.1 R1.1 U7.7
RELAY2: LED2.1 R12.1 U7.6
RELAY3: LED3.1 R25.1 U7.5
RELAY4: LED4.1 R28.1 U7.4
RELAY5: LED5.1 R31.1 U8.4
RELAY6: U7.2
ROUT1: F1.2 Q2.1 R3.2
ROUT2: F2.2 Q7.1 R24.2
ROUT3: F3.2 Q8.1 R27.2
ROUT4: F4.2 Q9.1 R30.2
ROUT5: F5.2 Q10.1 R33.2
SCL: U6.8 U8.7
SDA: U6.7 U7.1
SENS1: R4.2 SEN1.2 U8.6
SENS2: R5.2 SEN2.2 U8.5
SENS3: R6.2 SEN3.2 U7.3
$1N3492: CR2032.1 U6.6
$2N7067: F1.1 U12.5
$2N7071: F2.1 U12.4
$2N7077: F3.1 U12.3
$2N7084: F4.1 U12.2
$2N7104: F5.1 U12.1
$3N16978: LED2.2 R7.1
$3N17018: LED1.2 R20.2
$3N17114: LED3.2 R11.2
$3N17181: LED4.2 R15.1
$3N17236: LED5.2 R19.1

Pads without a net: SCREW1 1; SEN1 3; SEN2 3; SEN3 3; U1 3 5; U2 3 5; U6 1 3 4; U9 3 5; U10 3 5; U11 3 5; U12 6; U14 1 2 3; U15 1 2 3; U16 1 2 3; U17 1 2 3; U18 1 2 3; U19 1 2 3

## Via types
v1: diameter 0.61, hole 0.305, Top Layer to Bottom Layer, 17 vias
v2: diameter 2.5, hole 0.8, Top Layer to Bottom Layer, 5 vias
v3: diameter 1.3, hole 0.6, Top Layer to Bottom Layer, 2 vias

## Routing (per net, layer and track width the routed paths; a pad name or vN(x,y) marks a point on that pad's centre or on a via; arc(x,y) is an arc through that point)
3V3: length 84.1
  Top Layer w0.35: SJ1.1 14.21,43.86 SEN1.1 ; U6.2 37,14.04 37,12 35.7,10.7 U8.3 ; SEN2.1 14.32,28.62 SJ2.1
  Top Layer w0.5: 10.15,26.72 10.15,26.72 SEN2.1 ; 10.15,26.72 10.15,13 11.54,11.61 SEN3.1 14.2,13.38 SJ3.1 21.08,13.5 24.5,13.5 27.3,10.7 U8.3 ; 10.15,26.72 10.15,41.73 10.5,42.08 SEN1.1
+5V: length 51.3
  Top Layer w1: U13.4 61,17.5 v3(61,21) ; U8.1 32.97,5.62 C6.1 C7.1 v3(38.5,5.65)
  Bottom Layer w1: v3(38.5,5.65) 38.5,19.5 42.5,23.5 58.5,23.5 v3(61,21)
$3I14456\$1N339: length 2.7
  Top Layer w0.4: R1.2 92.86,4.69 92.92,4.63
$3I14456\$1N2139: length 11.8
  Top Layer w0.35: v1(98,21.2) 98,22.35 97.81,22.53
  Top Layer w0.4: R3.1 98.19,13.47 U1.4 v1(98,15.36)
  Bottom Layer w0.4: v1(98,15.36) v1(98,21.2)
$3I14456\$1N2143: length 4.6
  Top Layer w0.4: R2.1 92.61,13.34 U1.6
$3I14478\$1N339: length 2.7
  Top Layer w0.4: R12.2 120.83,4.69 120.89,4.63
$3I14478\$1N2139: length 11.8
  Top Layer w0.4: 125.78,22.53 125.97,22.35 v1(125.97,21.2) ; v1(125.97,15.36) U2.4 126.16,13.47 R24.1
  Bottom Layer w0.4: v1(125.97,15.36) v1(125.97,21.2)
$3I14478\$1N2143: length 4.6
  Top Layer w0.4: R16.1 120.58,13.34 U2.6
$3I14500\$1N339: length 2.7
  Top Layer w0.4: R25.2 148.82,4.69 148.88,4.63
$3I14500\$1N2139: length 11.8
  Top Layer w0.4: 153.78,22.53 153.96,22.35 v1(153.96,21.2) ; v1(153.96,15.36) U9.4 154.15,13.47 R27.1
  Bottom Layer w0.4: v1(153.96,15.36) v1(153.96,21.2)
$3I14500\$1N2143: length 4.6
  Top Layer w0.4: R26.1 148.57,13.34 U9.6
$3I14522\$1N339: length 2.7
  Top Layer w0.4: R28.2 176.82,4.69 176.88,4.63
$3I14522\$1N2139: length 11.8
  Top Layer w0.4: v1(181.96,15.36) U10.4 182.15,13.47 R30.1 ; v1(181.96,21.2) 181.96,22.35 181.77,22.53
  Bottom Layer w0.4: v1(181.96,15.36) v1(181.96,21.2)
$3I14522\$1N2143: length 4.6
  Top Layer w0.4: U10.6 176.56,13.34 R29.1
$3I14544\$1N339: length 2.7
  Top Layer w0.4: R31.2 204.81,4.69 204.87,4.63
$3I14544\$1N2139: length 11.8
  Top Layer w0.4: 209.77,22.53 209.95,22.35 v1(209.95,21.2) ; v1(209.95,15.36) U11.4 210.14,13.47 R33.1
  Bottom Layer w0.4: v1(209.95,15.36) v1(209.95,21.2)
$3I14544\$1N2143: length 4.6
  Top Layer w0.4: U11.6 204.56,13.34 R32.1
N$4: length 4.6
  Top Layer w0.35: R4.1 SJ1.2
N$5: length 4.6
  Top Layer w0.35: R5.1 SJ2.2
N$10: length 4.6
  Top Layer w0.35: SJ3.2 R6.1
NETZ_L: length 245.9
  Top Layer w0.35: Q2.4 88.48,18.07 R2.2
  Top Layer w0.4: Q10.4 200.43,18.07 R32.2 ; R29.2 172.43,18.07 Q9.4 ; R16.2 116.45,18.07 Q7.4 ; R26.2 144.44,18.07 146.59,20.22
  Top Layer w1: U12.7 125.1,46.7 U13.1
  Top Layer w3: Q9.4 v2(174.59,26) ; 146.59,20.22 v2(146.59,26) ; v2(118.5,26) 118.5,20.32 Q7.4 ; Q10.4 202.5,20.3 v2(202.5,26) ; Q2.4 90.5,20.35 v2(90.5,26)
  Bottom Layer w3: v2(90.5,26) v2(118.5,26) 124.5,26 127.5,29 127.5,28 129.5,26 v2(146.59,26) v2(174.59,26) v2(202.5,26) ; U12.7 127.8,29
NETZ_N: length 57.8
  Top Layer w1: U12.8 68.7,44 U13.2
RELAY1: length 54.6
  Top Layer w0.35: R1.1 88.05,4.5 v1(86.5,4.5) ; 45.22,5.61 46.11,5.61 48.5,8 53,8 53.58,7.42 LED1.1
  Bottom Layer w0.35: 45.22,5.61 46.83,4 86,4 v1(86.5,4.5)
RELAY2: length 95.6
  Top Layer w0.35: LED2.1 58.96,6.84 58.96,8.34 57.79,9.5 49,9.5 47.65,8.15 U7.6 ; R12.1 v1(114.5,4.69)
  Bottom Layer w0.35: U7.6 44.15,8.15 43.5,7.5 43.5,4.5 44.5,3.5 86.5,3.5 87.5,4.5 114.31,4.5 v1(114.5,4.69)
RELAY3: length 134.2
  Top Layer w0.35: LED3.1 65.5,6.38 65.5,9 63.81,10.69 45.22,10.69 ; v1(142.5,4.5) 144.01,4.5 R25.1
  Bottom Layer w0.35: v1(142.5,4.5) 142.35,4.35 115.35,4.35 115,4 88,4 87,3 44.36,3 43.05,4.31 43.05,10.05 43.69,10.69 45.22,10.69
RELAY4: length 172.6
  Top Layer w0.35: LED4.1 71.46,8.04 70.5,9 67.37,9 64.5,11.87 48.37,11.87 47,13.23 U7.4 ; R28.1 v1(170.5,4.69)
  Bottom Layer w0.35: v1(170.5,4.69) 143.69,4.69 142.87,3.87 115.87,3.87 115.55,3.55 88.55,3.55 87.5,2.5 44.22,2.5 42.6,4.13 42.6,12.6 43.23,13.23 U7.4
RELAY5: length 238.8
  Top Layer w0.35: LED5.1 77.46,7.04 74.5,10 68.5,10 65,13.5 v1(49,13.5) ; R31.1 v1(198.5,4.69) ; v1(42,16) 34.5,16 31.74,13.24 U8.4
  Bottom Layer w0.35: v1(49,13.5) 49,22.28 48.78,22.5 43,22.5 42,21.5 v1(42,16) 42.14,15.86 42.14,3.94 44.03,2.05 88.05,2.05 89.1,3.1 115.74,3.1 116.06,3.42 143.06,3.42 143.7,4.06 170.76,4.06 171.39,4.69 v1(198.5,4.69)
ROUT1: length 25.7
  Top Layer w0.4: 100.23,17.96 100.8,17.39 R3.2
  Top Layer w1: F1.2 98.04,29.46 102.5,25 102.5,19 101.46,17.96 Q2.1
ROUT2: length 25.7
  Top Layer w0.35: R24.2 128.76,17.39 128.2,17.96
  Top Layer w1: Q7.1 129.46,17.96 130.5,19 130.5,25 126.04,29.46 F2.2
ROUT3: length 26.4
  Top Layer w0.4: 156.19,17.96 156.76,17.39 R27.2
  Top Layer w1: F3.2 154.54,29.46 159,25 159,19.5 157.46,17.96 Q8.1
ROUT4: length 25.7
  Top Layer w0.35: 184.19,17.96 184.75,17.39 R30.2
  Top Layer w1: Q9.1 185.46,17.96 186.5,19 186.5,25 182.04,29.46 F4.2
ROUT5: length 23.7
  Top Layer w0.35: R33.2 212.75,17.39 212.18,17.96
  Top Layer w1: 209.76,17.96 211.96,17.96 213.5,19.5 213.5,25.5 209.54,29.46 F5.2
SCL: length 6.8
  Top Layer w0.35: U8.7 35.14,20.86 35.59,20.41 U6.8
SDA: length 11.7
  Top Layer w0.35: U6.7 37,19.24 37,17.5 37.25,17.25 41.63,17.25 U7.1
SENS1: length 34.7
  Top Layer w0.35: 14.97,40.81 17.19,40.81 18,40 18,36.5 18.75,35.75 20.95,35.75 R4.2 22.5,35.75 23.5,34.75 23.5,20.5 25.68,18.32 U8.6
SENS2: length 20.8
  Top Layer w0.35: SEN2.2 17.05,25.45 18,24.5 18,21.5 19,20.5 20.95,20.5 R5.2 25.68,15.78 U8.5
SENS3: length 46.3
  Top Layer w0.35: U7.3 43.77,15.77 42.5,14.5 42.5,6 38,1.5 26.77,1.5 23,5.27 R6.2 19.23,5.27 18,6.5 18,9 16.66,10.34 SEN3.2
$1N3492: length 23.1
  Top Layer w0.35: U6.6 38.13,28.87 CR2032.1
$2N7067: length 49.4
  Top Layer w1: U12.5 131.96,38 95.96,38 F1.1
$2N7071: length 26.5
  Top Layer w1: U12.4 133.58,34.54 F2.1
$2N7077: length 9.6
  Top Layer w1: F3.1 148.5,43.62 U12.3
$2N7084: length 27.2
  Top Layer w1: U12.2 162.66,34.54 F4.1
$2N7104: length 50.1
  Top Layer w1: U12.1 195.04,44 F5.1
$3N16978: length 2.9
  Top Layer w0.35: LED2.2 57.02,4.24 R7.1
$3N17018: length 3
  Top Layer w0.35: LED1.2 51.02,4.24 R20.2
$3N17114: length 2.9
  Top Layer w0.35: R11.2 63.02,4.24 LED3.2
$3N17181: length 2.9
  Top Layer w0.35: LED4.2 69.02,4.24 R15.1
$3N17236: length 2.9
  Top Layer w0.35: R19.1 75.02,4.24 LED5.2

## Copper pours and planes (outline as drawn; the poured copper is in the pictures)
GND on Top Layer: 2.5,50 57,50 57,28 81.5,28 81.5,5.5 216.5,5.5 216.5,1 2.5,1

## Text on the board
Top Silkscreen Layer: N L x | 1 2 3 4 5
